# EAGLE design tessel (EAGLE 9.1.0)
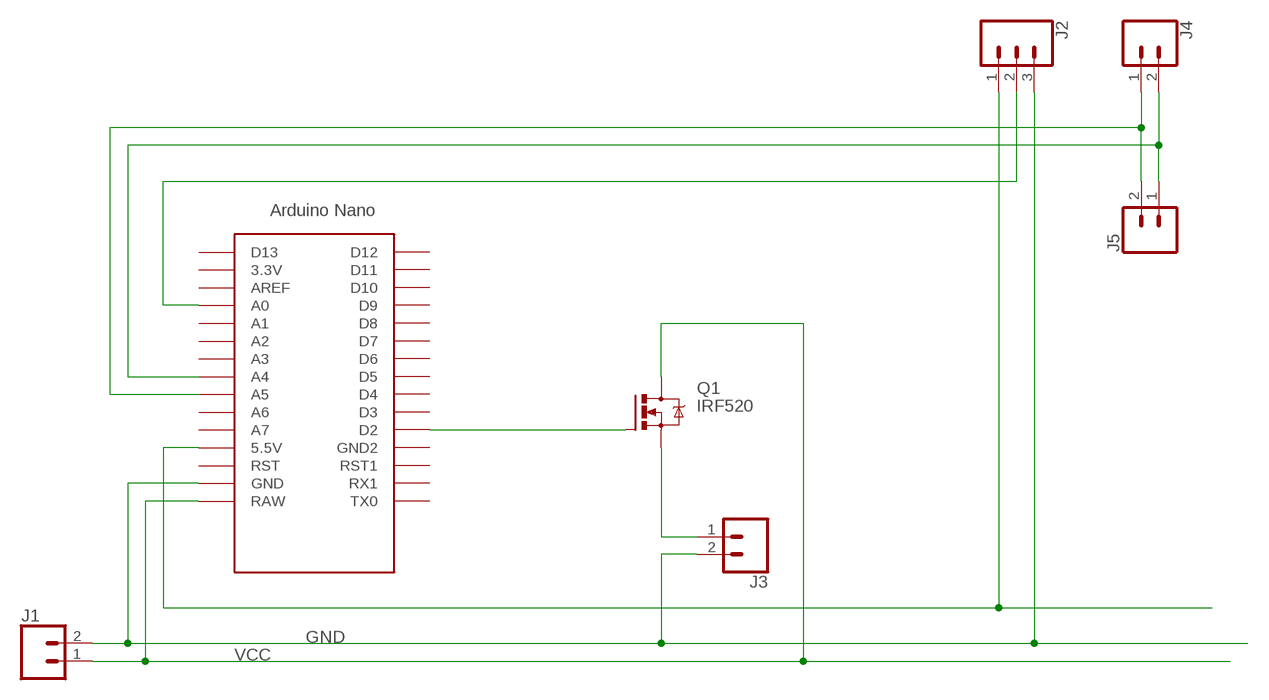
[diagram p0: schematic, sheet 1]

## Parts
J1  CONN_023.5MM_LOCK  [SCREWTERMINAL-3.5MM-2_LOCK]
J2  CONN_03LONGPADS  [1X03_LONGPADS]
J3  CONN_023.5MM_LOCK  [SCREWTERMINAL-3.5MM-2_LOCK]
J4  CONN_023.5MM_LOCK  [SCREWTERMINAL-3.5MM-2_LOCK]
J5  CONN_023.5MM_LOCK  [SCREWTERMINAL-3.5MM-2_LOCK]
Q1  IRF520  [TO220BV]
U$1  NANO  [NANO]

## Nets
GND: J1.2 J2.3 J3.2 U$1.GND
N$1: J2.1 U$1.5V(5.5V)
N$3: Q1.G U$1.D2
N$4: J3.1 Q1.S
N$5: J2.2 U$1.A0
N$6: J4.1 J5.2 U$1.A5
N$7: J4.2 J5.1 U$1.A4
VCC: J1.1 Q1.D U$1.RAW
Unconnected: U$1.3.3V U$1.A1 U$1.A2 U$1.A3 U$1.A6 U$1.A7 U$1.AREF U$1.D3 U$1.D4 U$1.D5 U$1.D6 U$1.D7 U$1.D8 U$1.D9 U$1.D10 U$1.D11 U$1.D12 U$1.D13 U$1.GND1(GND2) U$1.ICSP1 U$1.ICSP2 U$1.ICSP3 U$1.ICSP4 U$1.ICSP5 U$1.ICSP6 U$1.RST U$1.RST1 U$1.RX1 U$1.TX0

## Library data of the parts
J1 J3-J5 = SparkFun-Connectors:CONN_02: Multi connection point. Often used as Generic Header-pin footprint for 0.1 inch spaced/style header connections On any of the 0.1 inch spaced packages, you can populate with these: Break Away Headers - Straight <https://www.sparkfun.com/products/116> (PRT-00116) Break Away Male Headers - Right Angle <https://www.sparkfun.com/products/553> (PRT-00553) Female Headers <https://www.sparkfun.com/products/115> (PRT-00115) Break Away Headers - Machine Pin <https://www.sparkfun.com/products/117> (PRT-00117) Break Away Female Headers - Swiss Machine Pin <https://www.sparkfun.com/products/743> (PRT-00743) For SCREWTERMINALS and SPRING TERMINALS visit here: Screw Terimnals on SparkFun.com <https://www.sparkfun.com/search/results?term=Screw+Terminals> (5mm/3.5mm/2.54mm spacing) This device is also useful as a general connection point to wire up your design to another part of your project. Our various solder wires solder well into these plated through hole pads. Hook-Up Wire - Assortment (Stranded, 22 AWG) <https://www.sparkfun.com/products/11375> (PRT-11375) Hook-Up Wire - Assortment (Solid Core, 22 AWG) <https://www.sparkfun.com/products/11367> (PRT-11367) View the entire wire category on our website here <https://www.sparkfun.com/categories/141> Special notes: Molex polarized connector foot print use with: PRT-08233 with associated crimp pins and housings. 2.54_SCREWTERM for use with PRT-10571. 3.5mm Screw Terminal footprints for PRT-08084 5mm Screw Terminal footprints for use with PRT-08432; PROD_ID: CONN-08399
J2 = SparkFun-Connectors:CONN_03: Multi connection point. Often used as Generic Header-pin footprint for 0.1 inch spaced/style header connections On any of the 0.1 inch spaced packages, you can populate with these: Break Away Headers - Straight <https://www.sparkfun.com/products/116> (PRT-00116) Break Away Male Headers - Right Angle <https://www.sparkfun.com/products/553> (PRT-00553) Female Headers <https://www.sparkfun.com/products/115> (PRT-00115) Break Away Headers - Machine Pin <https://www.sparkfun.com/products/117> (PRT-00117) Break Away Female Headers - Swiss Machine Pin <https://www.sparkfun.com/products/743> (PRT-00743) Stackable Header - 3 Pin (Female, 0.1") <https://www.sparkfun.com/products/13875> (PRT-13875) For SCREWTERMINALS and SPRING TERMINALS visit here: Screw Terimnals on SparkFun.com <https://www.sparkfun.com/search/results?term=Screw+Terminals> (5mm/3.5mm/2.54mm spacing) This device is also useful as a general connection point to wire up your design to another part of your project. Our various solder wires solder well into these plated through hole pads. Hook-Up Wire - Assortment (Stranded, 22 AWG) <https://www.sparkfun.com/products/11375> (PRT-11375) Hook-Up Wire - Assortment (Solid Core, 22 AWG) <https://www.sparkfun.com/products/11367> (PRT-11367) View the entire wire category on our website here <https://www.sparkfun.com/categories/141> Special notes: Molex polarized connector foot print use with SKU : PRT-08232 with associated crimp pins and housings.
Q1 = transistor-power:IRF520: HEXFET Power MOSFET
U$1 = Arduino-clone:NANO: Arduino Nano

## Board
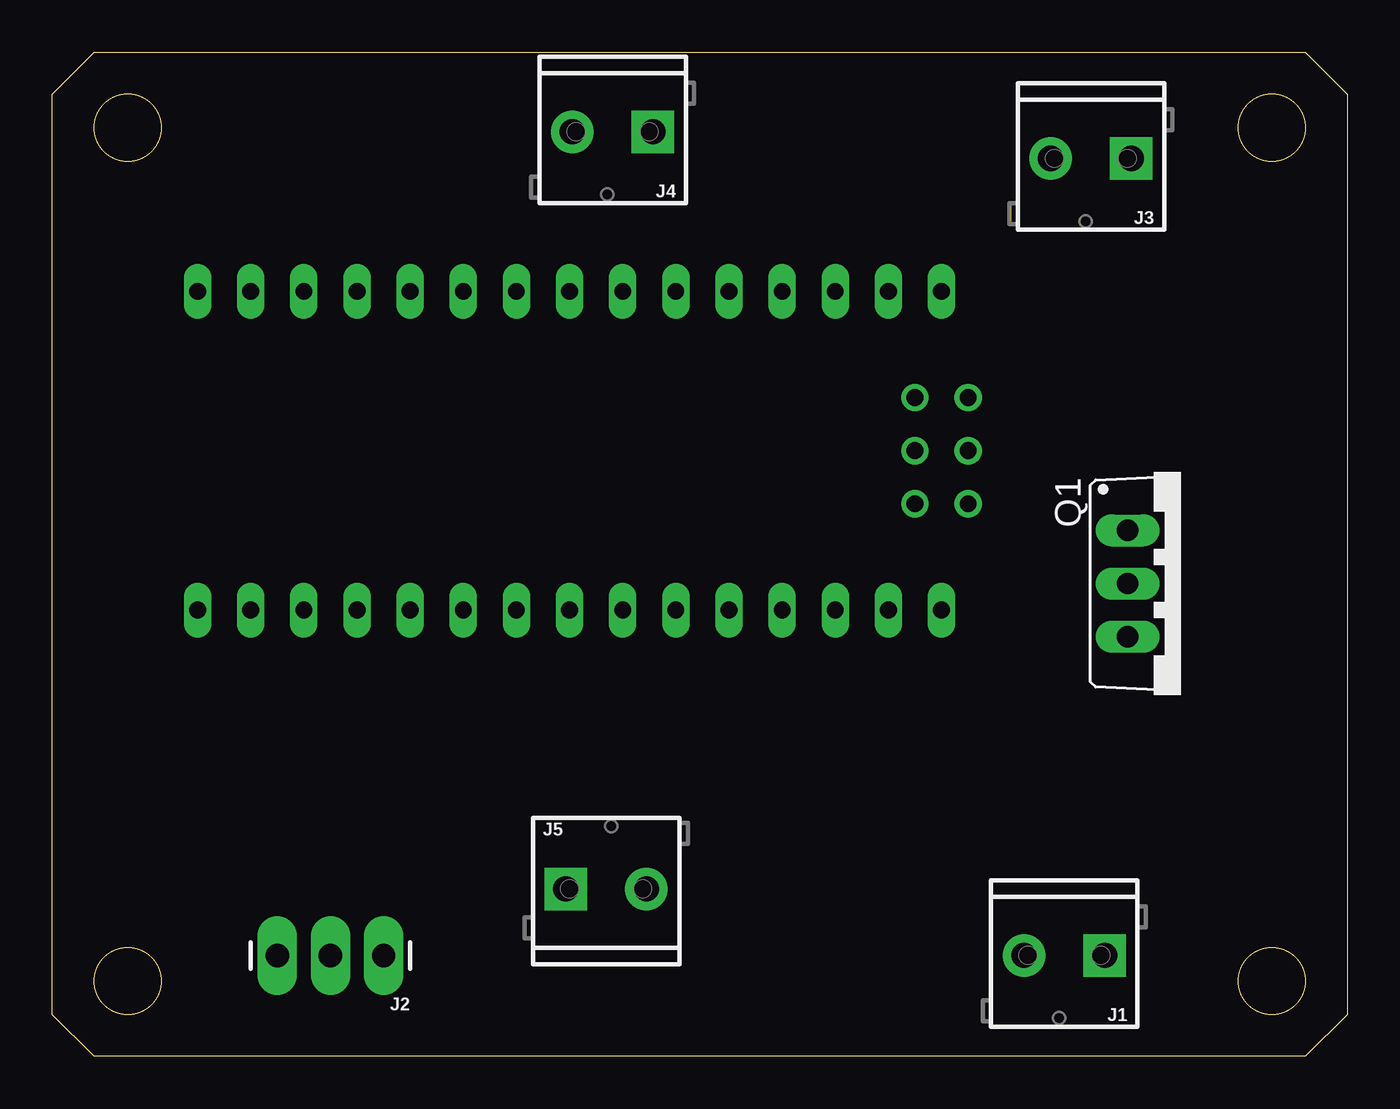
[diagram p1: board, top side]
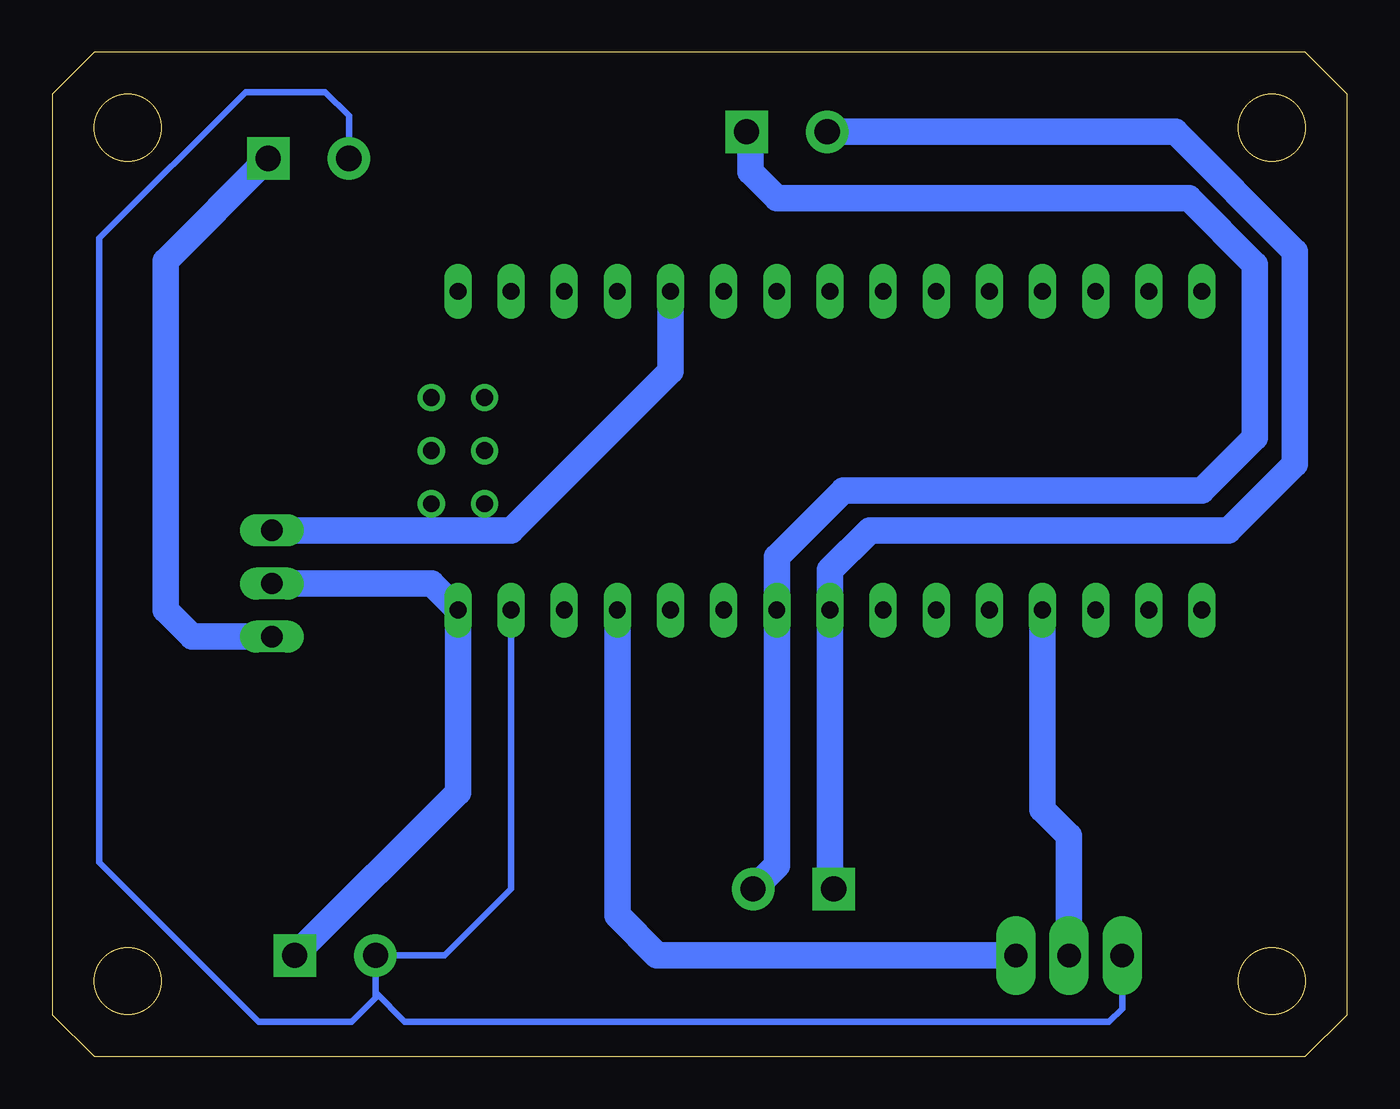
[diagram p2: board, bottom side, seen from below]

Size 61.9 x 48 mm. Coordinates in mm from the lower left corner, seen from the top.
Outline: 0,2 0,46 2,48 59.9,48 61.9,46 61.9,2 59.9,0 2,0 0,2
Outline: circle at 58.3,3.6 radius 1.6
Outline: circle at 3.6,3.6 radius 1.6
Outline: circle at 3.6,44.4 radius 1.6
Outline: circle at 58.3,44.4 radius 1.6
Copper layers (1*16): Top 0.035mm / dielectric 1.5mm / Bottom 0.035mm
Design rules "default": minimum track width 6mil, minimum drill 0.35mm, track to track 6mil, track to pad 6mil, pad to pad 6mil, via to via 6mil, smd to smd 6mil, copper to edge 40mil, drill to drill 6mil, minimum pad ring 10mil, minimum via ring 8mil, stop-mask expansion 4mil, vias tented up to drill 0mil, thermal gap 10mil

### Footprints (pad centres in the part's own frame; a part is rotated, then mirrored left to right if it is on the bottom)
SCREWTERMINAL-3.5MM-2_LOCK = drill 1.2 pad 2.032 square: 1 -0.178,0 | drill 1.2 pad 2.032: 2 3.678,0
1X03_LONGPADS = drill 1.118 pad 1.88 long: 1 0,0; 2 2.54,0; 3 5.08,0
TO220BV = drill 1.016 long: D 0,-2.54; G -2.54,-2.54; S 2.54,-2.54
NANO = drill 0.8 long: 3.3V -10.16,24.13; 5V -10.16,-1.27; A0 -10.16,19.05; A1 -10.16,16.51; A2 -10.16,13.97; A3 -10.16,11.43; A4 -10.16,8.89; A5 -10.16,6.35; A6 -10.16,3.81; A7 -10.16,1.27; AREF -10.16,21.59; D2 5.08,1.27; D3 5.08,3.81; D4 5.08,6.35; D5 5.08,8.89; D6 5.08,11.43; D7 5.08,13.97; D8 5.08,16.51; D9 5.08,19.05; D10 5.08,21.59; D11 5.08,24.13; D12 5.08,26.67; D13 -10.16,26.67; GND -10.16,-6.35; GND1 5.08,-1.27; RAW -10.16,-8.89; RST -10.16,-3.81; RST1 5.08,-3.81; RX1 5.08,-6.35; TX0 5.08,-8.89 | drill 0.8: ICSP1 -5.08,-10.16; ICSP2 -5.08,-7.62; ICSP3 -2.54,-10.16; ICSP4 -2.54,-7.62; ICSP5 0,-10.16; ICSP6 0,-7.62

### Placement (x,y rotation side)
J1  50.12,4.83 180 top
J2  15.83,4.83 180 top
J3  51.39,42.93 180 top
J4  28.53,44.2 180 top
J5  24.72,8 0 top
Q1  53.93,22.61 270 top
U$1  33.61,31.5 90 top

### Tracks (layer width: path | path; a pad name or v marks a point on that pad's centre or on a via)
GND
  Bottom 0.305: J2.3 10.75,2.29 11.39,1.65 45.04,1.65 46.45,3.05 | 46.45,3.05 J1.2 43.14,4.83 39.96,8 U$1.GND | J3.2 47.72,44.96 48.85,46.1 52.66,46.1 59.65,39.12 59.65,9.27 52.03,1.65 47.58,1.65 46.45,2.79 46.45,3.05
N$1
  Bottom 1.27: J2.1 32.98,4.83 34.88,6.73 U$1.5V
N$3
  Bottom 1.27: Q1.G 39.96,25.15 32.34,32.77 U$1.D2
N$4
  Bottom 1.27: Q1.S 55.2,20.07 56.47,21.34 56.47,38.02 J3.1
N$5
  Bottom 1.27: J2.2 13.29,10.54 14.56,11.81 U$1.A0
N$6
  Bottom 1.27: J5.2 27.26,9.14 U$1.A5 27.26,23.88 24.09,27.05 6.94,27.05 4.4,29.59 4.4,37.85 7.58,41.02 27.26,41.02 28.53,42.29 28.53,44.02 J4.1
N$7
  Bottom 1.27: J5.1 24.72,8.18 U$1.A4 24.72,23.24 22.82,25.15 5.67,25.15 2.5,28.32 2.5,38.48 8.21,44.2 J4.2
VCC
  Bottom 1.27: J1.1 42.5,12.62 U$1.RAW 43.77,22.61 Q1.D